# Altium schematic sheet CoreBase-V2.0.SchDoc
size A2
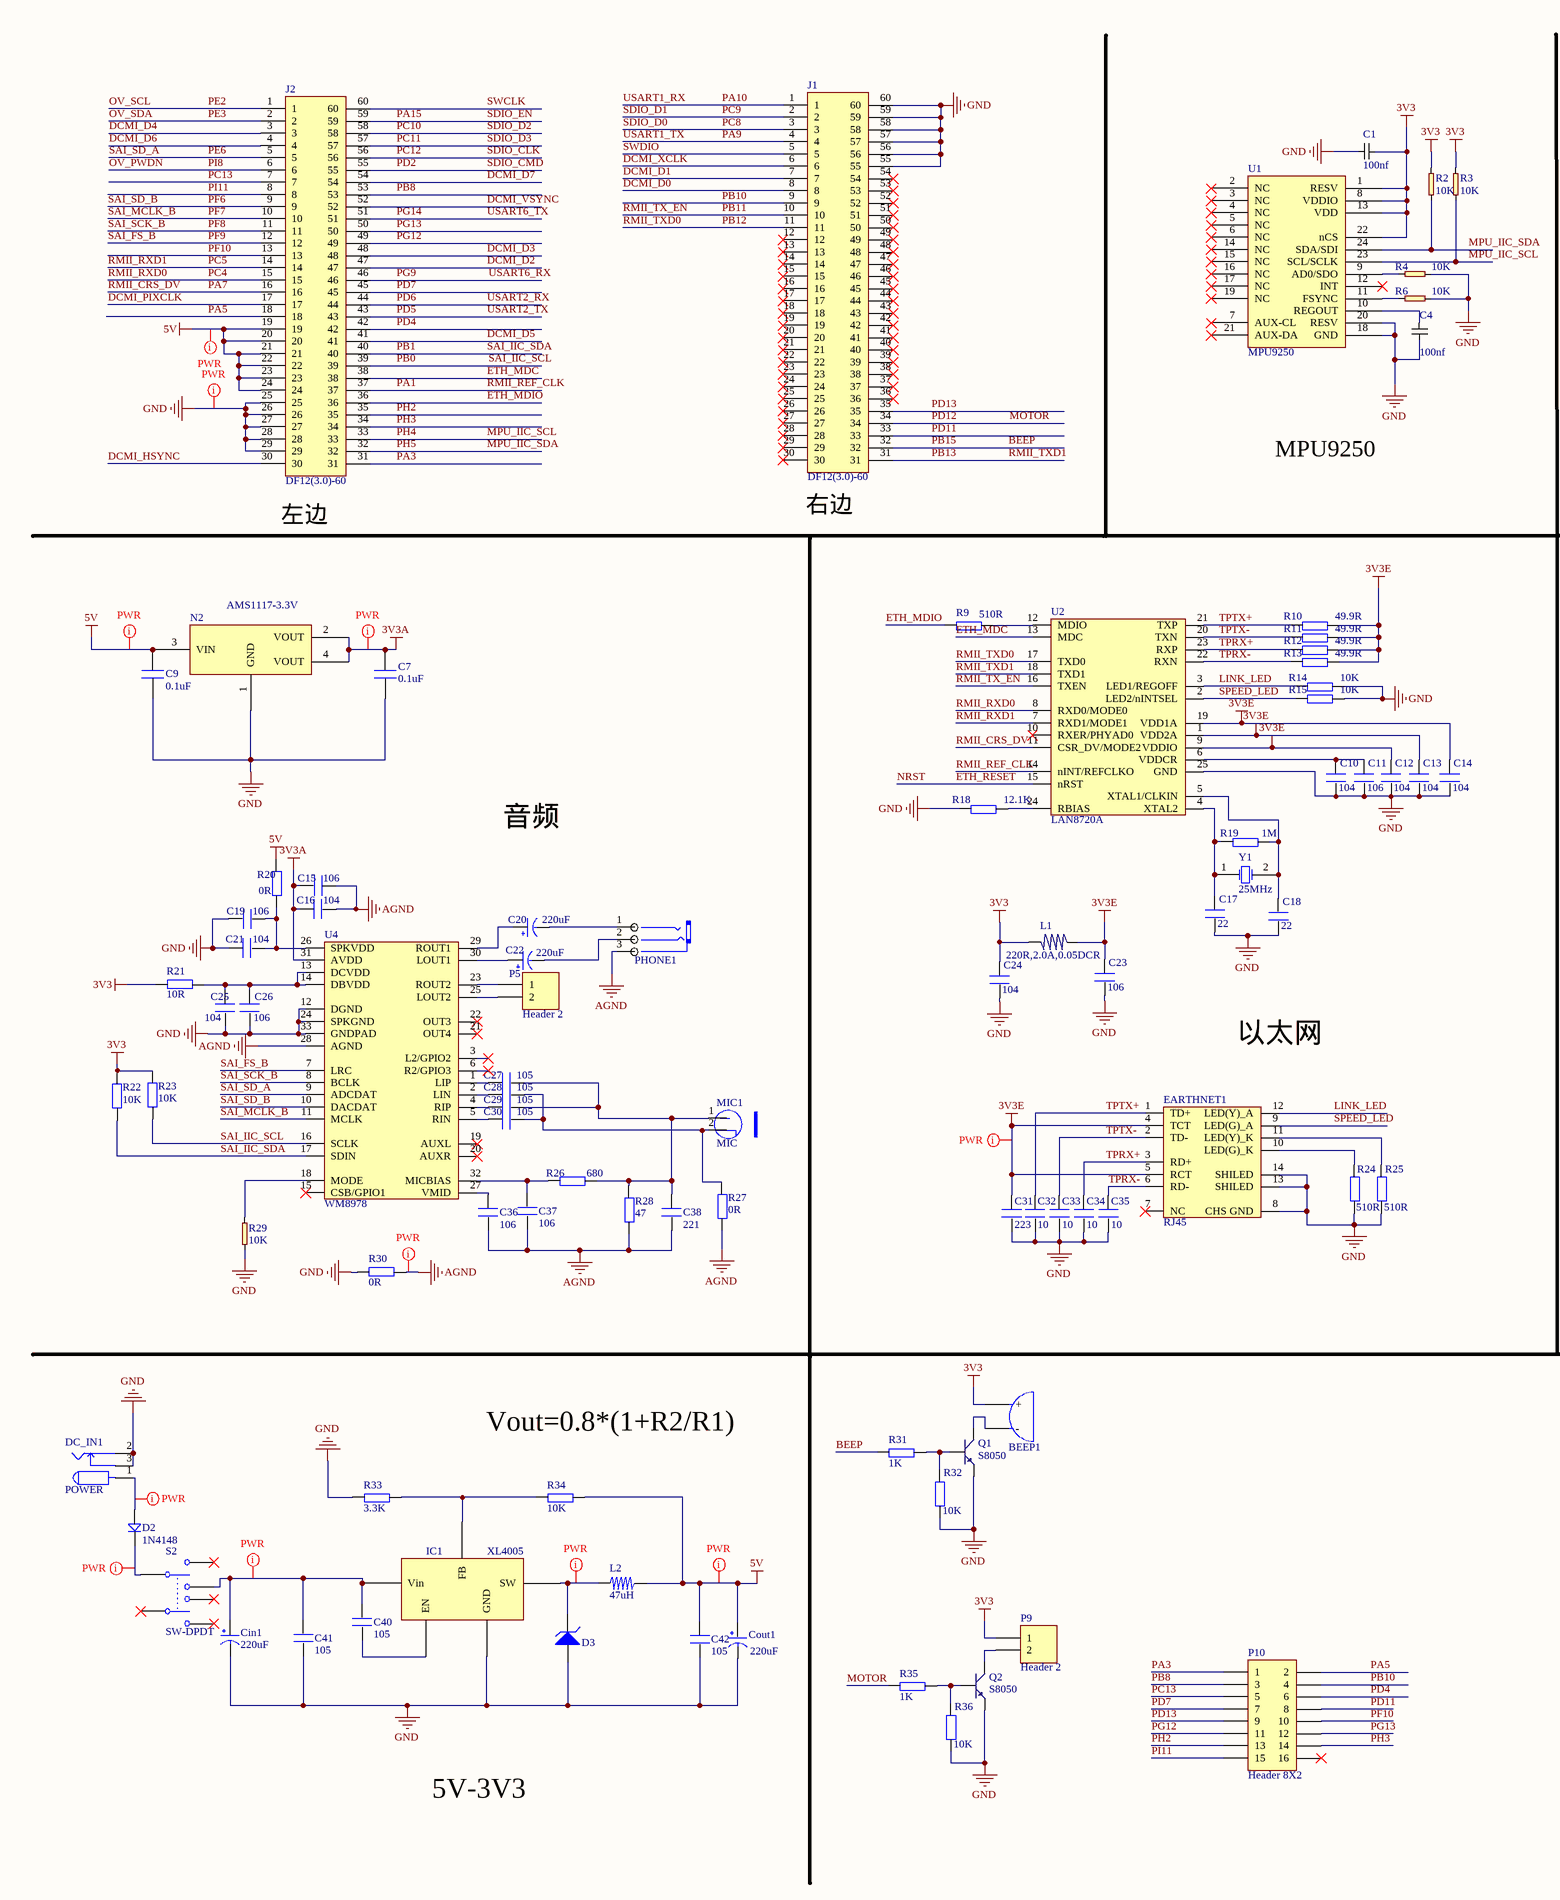
[diagram p0: CoreBase-V2.0.SchDoc, left]
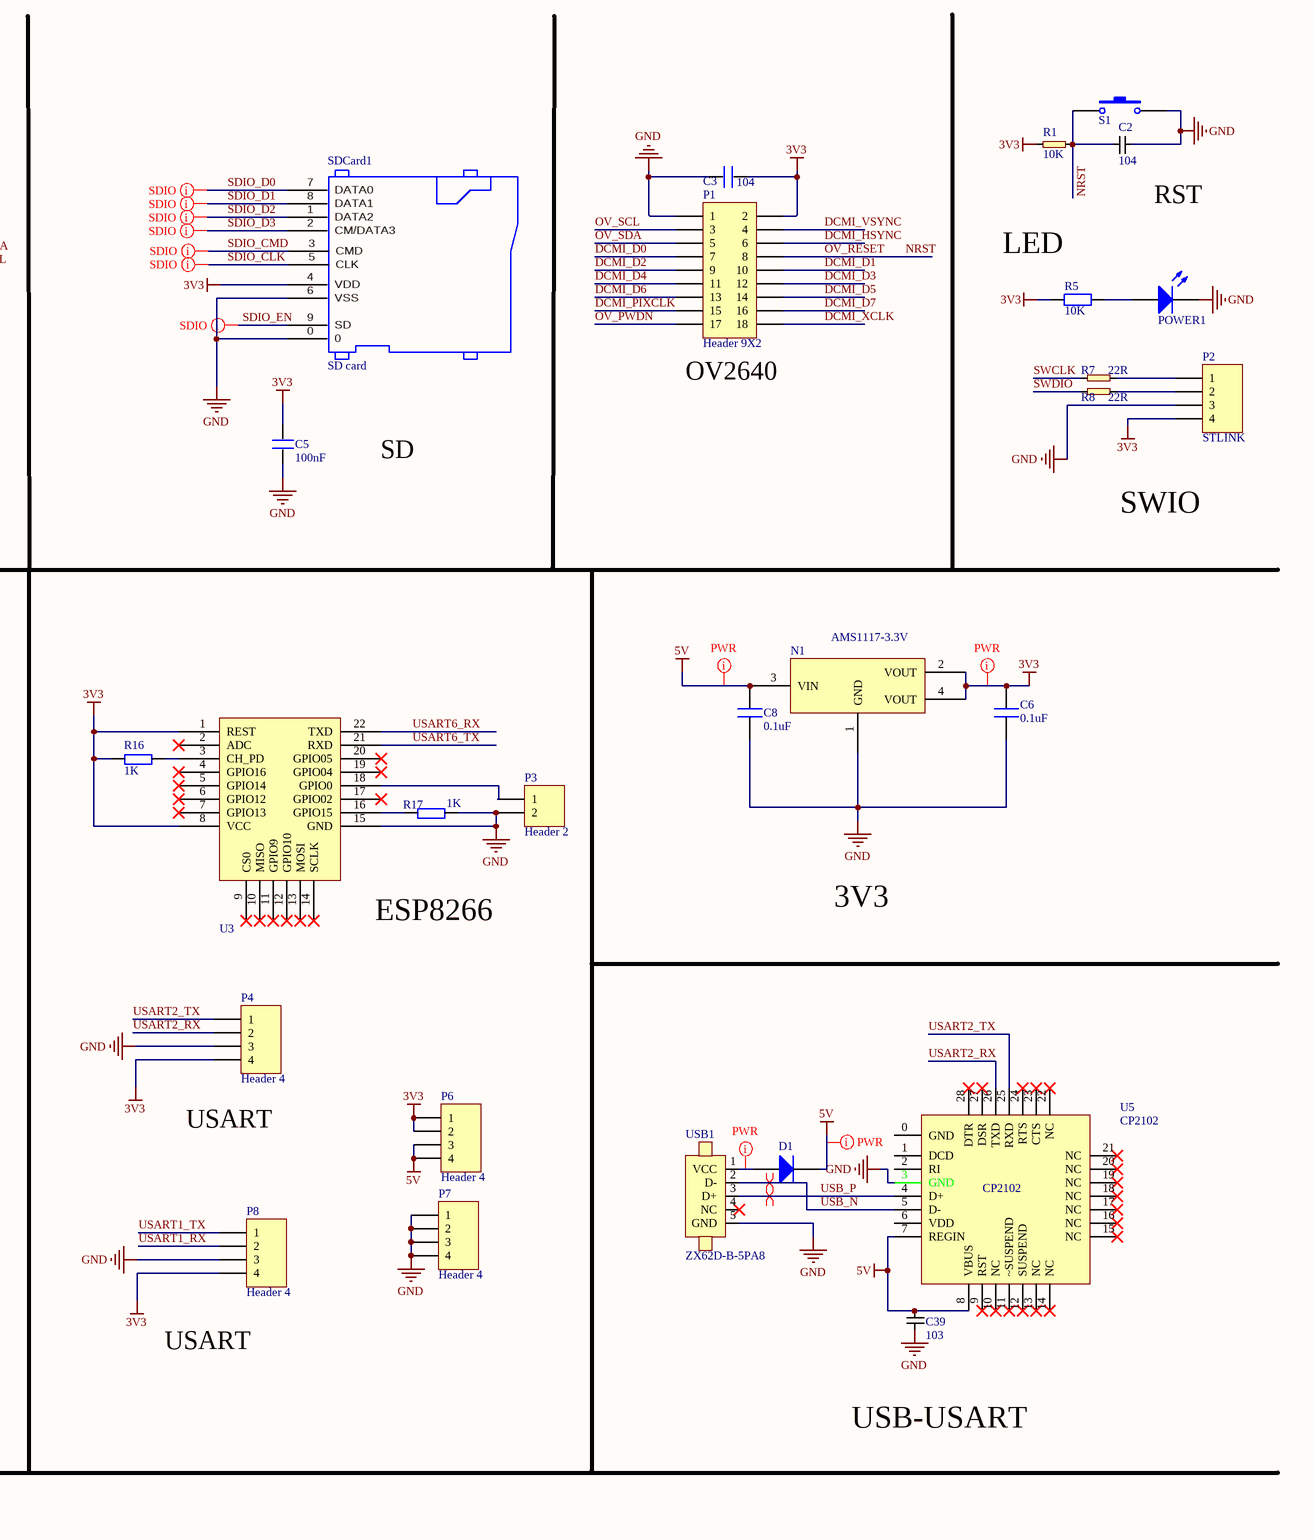
[diagram p1: CoreBase-V2.0.SchDoc, right]

## Parts
BEEP1  BEEP  [SOT12-7.6]  (value not drawn)
C1  100nf  [0603_C]
C2  104  [0603_C]
C3  104  [0603_C]
C4  100nf  [0603_C]
C5  100nF  [0603_C]
C6  0.1uF  [0603_C]
C7  0.1uF  [0603_C]
C8  0.1uF  [0603_C]
C9  0.1uF  [0603_C]
C10  104  [0603_C]
C11  106  [0603_C]
C12  104  [0603_C]
C13  104  [0603_C]
C14  104  [0603_C]
C15  106  [0603_C]
C16  104  [0603_C]
C17  22  [0603_C]
C18  22  [0603_C]
C19  106  [0603_C]
C20  220uF  [CC6.56.5]
C21  104  [0603_C]
C22  220uF  [CC6.56.5]
C23  106  [0603_C]
C24  104  [0603_C]
C25  104  [0603_C]
C26  106  [0603_C]
C27  105  [0603_C]
C28  105  [0603_C]
C29  105  [0603_C]
C30  105  [0603_C]
C31  223  [0603_C]
C32  10  [0603_C]
C33  10  [0603_C]
C34  10  [0603_C]
C35  10  [0603_C]
C36  106  [0603_C]
C37  106  [0603_C]
C38  221  [0603_C]
C39  103  [0603_C]
C40  105  [0603_C]
C41  105  [0603_C]
C42  105  [0603_C]
Cin1  220uF  [CC6.56.5]
Cout1  220uF  [CC6.56.5]
D1  1N5819  [SOD-123]  (value not drawn)
D2  1N4148  [SOD-123]
D3  Diode  Zener  [SMA(DO-214AC)]  (value not drawn)
DC_IN1  POWER  [DC10B]
EARTHNET1  RJ45  [HR911105A]
IC1  XL4005  [TO-263-5]
J1  DF12(3.0)-60  [DF12(3.0)-60DS-Top]
J2  DF12(3.0)-60  [DF12(3.0)-60DS-TOP]
L1  220R,2.0A,0.05DCR  [0603P]
L2  47uH  [L_SOP74]
MIC1  MIC  [MIC-6022]
N1  AMS1117-3.3V  [SOT223]
N2  AMS1117-3.3V  [SOT223]
P1  Header 9X2  [HDR2X9]
P2  STLINK  [HDR1X4]
P3  Header 2  [HDR1X2]
P4  Header 4  [HDR1X4]
P5  Header 2  [HDR1X2]
P6  Header 4  [HDR1X4]
P7  Header 4  [HDR1X4]
P8  Header 4  [HDR1X4]
P9  Header 2  [HDR1X2]
P10  Header 8X2  [HDR2X8]
PHONE1  PHONE  [PHONE_ST]  (value not drawn)
POWER1  LED  [0603P]  (value not drawn)
Q1  S8050  [SOT-23R]
Q2  S8050  [SOT-23R]
R1  10K  [0603_R]
R2  10K  [0603_R]
R3  10K  [0603_R]
R4  10K  [0603_R]
R5  10K  [0603_R]
R6  10K  [0603_R]
R7  22R  [0603_R]
R8  22R  [0603_R]
R9  510R  [0603_R]
R10  49.9R  [0603_R]
R11  49.9R  [0603_R]
R12  49.9R  [0603_R]
R13  49.9R  [0603_R]
R14  10K  [0603_R]
R15  10K  [0603_R]
R16  1K  [0603_R]
R17  1K  [0603_R]
R18  12.1K  [0603_R]
R19  1M  [0603_R]
R20  0R  [0603_R]
R21  10R  [0603_R]
R22  10K  [0603_R]
R23  10K  [0603_R]
R24  510R  [0603_R]
R25  510R  [0603_R]
R26  680  [0603_R]
R27  0R  [0603_R]
R28  47  [0603_R]
R29  10K  [0603_R]
R30  0R  [0603_R]
R31  1K  [0603_R]
R32  10K  [0603_R]
R33  3.3K  [0603_R]
R34  10K  [0603_R]
R35  1K  [0603_R]
R36  10K  [0603_R]
S1  SW-PB  [SW-3625]  (value not drawn)
S2  SW-DPDT  [SW-DPDT]
SDCard1  SD card  [SD_CARD]
U1  MPU9250  [QFN24]
U2  LAN8720A  [QFN24]
U3  ESP8266  [ESP-8266]  (value not drawn)
U4  WM8978  [WM8978]
U5  CP2102  [QFN-28]
USB1  ZX62D-B-5PA8  [Micro_USB]
Y1  25MHz  [XTAL_US]

## Nets
3V3: BEEP1.1(+) C1.1 C3.2 C5.2 C6.1 C24.2 L1.2 N1.2(VOUT) N1.4(VOUT) P1.2 P2.4 P4.4 P6.1 P6.2 P8.4 P9.1 R1.1 R2.2 R3.2 R5.1 R16.1 R21.2 R22.1 R23.1 SDCard1.4(VDD) U1.1(RESV) U1.8(VDDIO) U1.13(VDD) U1.22(nCS) U3.1(REST) U3.8(VCC)
3V3A: C7.1 C15.2 C16.1 N2.2(VOUT) N2.4(VOUT) U4.31(AVDD)
3V3E: C12.2 C13.2 C14.2 C23.2 C31.2 EARTHNET1.4(TCT) EARTHNET1.5(RCT) L1.1 R10.2 R11.2 R12.2 R13.2 U2.1(VDD2A) U2.9(VDDIO) U2.19(VDD1A)
5V: C8.1 C9.1 C39.2 C42.2 Cout1.1(VCC) D1.2(N) J2.19 J2.20 J2.21 J2.22 J2.23 J2.24 L2.1 N1.3(VIN) N2.3(VIN) P6.3 P6.4 R20.2 R34.2 U5.7(REGIN) U5.8(VBUS)
AGND: C15.1 C16.2 C36.1 C37.1 C38.1 PHONE1.3(COM) R27.1 R28.1 R30.1 U4.28(AGND)
GND: C1.2 C2.2 C3.1 C4.1 C5.1 C6.2 C7.2 C8.2 C9.2 C10.1 C11.1 C12.1 C13.1 C14.1 C17.1 C18.1 C19.2 C21.1 C23.1 C24.1 C25.1 C26.1 C31.1 C32.1 C33.1 C34.1 C35.1 C39.1 C41.1 C42.1 Cin1.2(GND) Cout1.2(GND) D3.1(A) DC_IN1.2 DC_IN1.3 EARTHNET1.8(CHS_GND) EARTHNET1.13(SHILED) EARTHNET1.14(SHILED) IC1.1(GND) J1.55 J1.56 J1.57 J1.58 J1.59 J1.60 J2.25 J2.26 J2.27 J2.28 J2.29 N1.1(GND) N2.1(GND) P1.1 P2.3 P3.2 P4.3 P7.1 P7.2 P7.3 P7.4 P8.3 POWER1.2(K) Q1.1(E) Q2.1(E) R4.1 R6.1 R14.2 R15.2 R17.2 R18.1 R24.1 R25.1 R29.1 R30.2 R32.1 R33.1 R36.1 S1.2 SDCard1.0 SDCard1.6(VSS) U1.18(GND) U1.20(RESV) U2.25(GND) U3.15(GND) U4.12(DGND) U4.24(SPKGND) U4.33(GNDPAD) U5.3(GND) USB1.5(GND)
BEEP: J1.32 R31.1  [also labelled PB15]
DCMI_D0: J1.8 P1.7
DCMI_D1: J1.7 P1.10
DCMI_D2: J2.47 P1.9
DCMI_D3: J2.48 P1.12
DCMI_D4: J2.3 P1.11
DCMI_D5: J2.41 P1.14
DCMI_D6: J2.4 P1.13
DCMI_D7: J2.54 P1.16
DCMI_HSYNC: J2.30 P1.6
DCMI_PIXCLK: J2.17 P1.15
DCMI_VSYNC: J2.52 P1.4
DCMI_XCLK: J1.6 P1.18
ETH_MDC: J2.38 U2.13(MDC)
ETH_MDIO: J2.36 R9.1
ETH_RESET: C2.1 P1.8 R1.2 S1.1 U2.15(nRST)  [also labelled NRST, OV_RESET]
LINK_LED: EARTHNET1.12(LED(Y)_A) R14.1 U2.3(LED1/REGOFF)
MOTOR: J1.34 R35.1  [also labelled PD12]
MPU_IIC_SCL: J2.33 R3.1 U1.23(SCL/SCLK)  [also labelled PH4]
MPU_IIC_SDA: J2.32 R2.1 U1.24(SDA/SDI)  [also labelled PH5]
OV_PWDN: J2.6 P1.17  [also labelled PI8]
OV_SCL: J2.1 P1.3  [also labelled PE2]
OV_SDA: J2.2 P1.5  [also labelled PE3]
PA1: J2.37 U2.14(nINT/REFCLKO)  [also labelled RMII_REF_CLK]
PA3: J2.31 P10.1
PA5: J2.18 P10.2
PA7: J2.16 U2.11(CSR_DV/MODE2)  [also labelled RMII_CRS_DV]
PA9: J1.4 P8.1  [also labelled USART1_TX]
PA10: J1.1 P8.2  [also labelled USART1_RX]
PA15: J2.59 SDCard1.9(SD)  [also labelled SDIO_EN]
PB0: J2.39 R23.2 U4.16(SCLK)  [also labelled SAI_IIC_SCL]
PB1: J2.40 R22.2 U4.17(SDIN)  [also labelled SAI_IIC_SDA]
PB8: J2.53 P10.3
PB10: J1.9 P10.4
PB11: J1.10 U2.16(TXEN)  [also labelled RMII_TX_EN]
PB12: J1.11 U2.17(TXD0)  [also labelled RMII_TXD0]
PB13: J1.31 U2.18(TXD1)  [also labelled RMII_TXD1]
PC4: J2.15 U2.8(RXD0/MODE0)  [also labelled RMII_RXD0]
PC5: J2.14 U2.7(RXD1/MODE1)  [also labelled RMII_RXD1]
PC8: J1.3 SDCard1.7(DATA0)  [also labelled SDIO_D0]
PC9: J1.2 SDCard1.8(DATA1)  [also labelled SDIO_D1]
PC10: J2.58 SDCard1.1(DATA2)  [also labelled SDIO_D2]
PC11: J2.57 SDCard1.2(CM/DATA3)  [also labelled SDIO_D3]
PC12: J2.56 SDCard1.5(CLK)  [also labelled SDIO_CLK]
PC13: J2.7 P10.5
PD2: J2.55 SDCard1.3(CMD)  [also labelled SDIO_CMD]
PD4: J2.42 P10.6
PD5: J2.43 P4.1 U5.25(RXD)  [also labelled USART2_TX]
PD6: J2.44 P4.2 U5.26(TXD)  [also labelled USART2_RX]
PD7: J2.45 P10.7
PD11: J1.33 P10.8
PD13: J1.35 P10.9
PE6: J2.5 U4.9(ADCDAT)  [also labelled SAI_SD_A]
PF6: J2.9 U4.10(DACDAT)  [also labelled SAI_SD_B]
PF7: J2.10 U4.11(MCLK)  [also labelled SAI_MCLK_B]
PF8: J2.11 U4.8(BCLK)  [also labelled SAI_SCK_B]
PF9: J2.12 U4.7(LRC)  [also labelled SAI_FS_B]
PF10: J2.13 P10.10
PG9: J2.46 U3.22(TXD)  [also labelled USART6_RX]
PG12: J2.49 P10.11
PG13: J2.50 P10.12
PG14: J2.51 U3.21(RXD)  [also labelled USART6_TX]
PH2: J2.35 P10.13
PH3: J2.34 P10.14
PI11: J2.8 P10.15
SPEED_LED: EARTHNET1.9(LED(G)_A) R15.1 U2.2(LED2/nINTSEL)
SWCLK: J2.60 R7.1
SWDIO: J1.5 R8.1
TPRX+: C34.2 EARTHNET1.3(RD+) R12.1 U2.23(RXP)
TPRX-: C35.2 EARTHNET1.6(RD-) R13.1 U2.22(RXN)
TPTX+: C32.2 EARTHNET1.1(TD+) R10.1 U2.21(TXP)
TPTX-: C33.2 EARTHNET1.2(TD-) R11.1 U2.20(TXN)
USB_N: U5.5(D-) USB1.2(D-)
USB_P: U5.4(D+) USB1.3(D+)
NetBEEP1_2: BEEP1.2(-) Q1.3(C)
NetC4_2: C4.2 U1.10(REGOUT)
NetC10_2: C10.2 C11.2 U2.6(VDDCR)
NetC17_2: C17.2 R19.1 U2.4(XTAL2) Y1.1(OSC1)
NetC18_2: C18.2 R19.2 U2.5(XTAL1/CLKIN) Y1.2(OSC2)
NetC19_1: C19.1 C21.2 R20.1 U4.26(SPKVDD)
NetC20_1: C20.1(VCC) U4.29(ROUT1)
NetC20_2: C20.2(GND) PHONE1.1(CHL)
NetC22_1: C22.1(VCC) U4.30(LOUT1)
NetC22_2: C22.2(GND) PHONE1.2(CHR)
NetC25_2: C25.2 C26.2 R21.1 U4.13(DCVDD) U4.14(DBVDD)
NetC27_1: C27.1 U4.1(LIP)
NetC27_2: C27.2 C29.2 C38.2 MIC1.1(VCC) R26.2 R28.2
NetC28_1: C28.1 U4.2(LIN)
NetC28_2: C28.2 C30.2 MIC1.2(GND) R27.2
NetC29_1: C29.1 U4.4(RIP)
NetC30_1: C30.1 U4.5(RIN)
NetC36_2: C36.2 U4.27(VMID)
NetC37_2: C37.2 R26.1 U4.32(MICBIAS)
NetC40_1: C40.1 IC1.4(EN)
NetC40_2: C40.2 C41.2 Cin1.1(VCC) IC1.5(Vin) S2.3
NetD1_1: D1.1(P) USB1.1(VCC)
NetD2_1: D2.1 DC_IN1.1
NetD2_2: D2.2 S2.2
NetD3_2: D3.2(K) IC1.3(SW) L2.2
NetEARTHNET1_10: EARTHNET1.10(LED(G)_K) R24.2
NetEARTHNET1_11: EARTHNET1.11(LED(Y)_K) R25.2
NetIC1_2: IC1.2(FB) R33.2 R34.1
NetP2_1: P2.1 R7.2
NetP2_2: P2.2 R8.2
NetP3_1: P3.1 U3.18(GPIO0)
NetP5_1: P5.1 U4.23(ROUT2)
NetP5_2: P5.2 U4.25(LOUT2)
NetP9_2: P9.2 Q2.3(C)
NetPOWER1_1: POWER1.1(A) R5.2
NetQ1_2: Q1.2(B) R31.2 R32.2
NetQ2_2: Q2.2(B) R35.2 R36.2
NetR4_2: R4.2 U1.9(AD0/SDO)
NetR6_2: R6.2 U1.11(FSYNC)
NetR9_2: R9.2 U2.12(MDIO)
NetR16_2: R16.2 U3.3(CH_PD)
NetR17_1: R17.1 U3.16(GPIO15)
NetR18_2: R18.2 U2.24(RBIAS)
NetR29_2: R29.2 U4.18(MODE)

Not connected (* = marked no-connect by the designer): EARTHNET1 7(NC)*; J1 12* 13* 14* 15* 16* 17* 18* 19* 20* 21* 22* 23* 24* 25* 26* 27* 28* 29* 30* 36* 37* 38* 39* 40* 41* 42* 43* 44* 45* 46* 47* 48* 49* 50* 51* 52* 53* 54*; P10 16*; S2 1* 4* 5* 6*; U1 2(NC)* 3(NC)* 4(NC)* 5(NC)* 6(NC)* 7(AUX-CL)* 12(INT)* 14(NC)* 15(NC)* 16(NC)* 17(NC)* 19(NC)* 21(AUX-DA)*; U2 10(RXER/PHYAD0)*; U3 2(ADC)* 4(GPIO16)* 5(GPIO14)* 6(GPIO12)* 7(GPIO13)* 9(CS0)* 10(MISO)* 11(GPIO9)* 12(GPIO10)* 13(MOSI)* 14(SCLK)* 17(GPIO02)* 19(GPIO04)* 20(GPIO05)*; U4 3(L2/GPIO2)* 6(R2/GPIO3)* 15(CSB/GPIO1)* 19(AUXL)* 20(AUXR)* 21(OUT4)* 22(OUT3)*; U5 0(GND) 1(DCD) 2(RI) 6(VDD) 9(RST)* 10(NC)* 11(~SUSPEND)* 12(SUSPEND)* 13(NC)* 14(NC)* 15(NC)* 16(NC)* 17(NC)* 18(NC)* 19(NC)* 20(NC)* 21(NC)* 22(NC)* 23(CTS)* 24(RTS)* 27(DSR)* 28(DTR)*; USB1 4(NC)*

## Layout directives
net class SDIO: PA15, PC8, PC9, PC10, PC11, PC12, PD2
net class PWR: 3V3, 3V3A, 3V3E, 5V, AGND, GND, NetC40_2, NetD1_1, NetD2_1, NetD2_2, NetD3_2
differential pair: USB_N, USB_P

## Notes on the sheet
- RST
- (near R5) LED
- (near P1) OV2640
- MPU9250
- SD
- (near J2) 左边
- (near J1) 右边
- SWIO
- 音频
- (near U3) ESP8266
- 3V3
- 以太网
- (near P4) USART
- USART
- USB-USART
- Vout=0.8*(1+R2/R1)
- 5V-3V3

## Library data of the parts
C1-C5 C10-C19 C21 C23-C42 = C
C6-C9 = 普通贴片电容: Capacitor
C20 C22 Cin1 Cout1 = CAP
D1 D2 = D
D3 = Diode  Zener: Zener Diode; Published: 8-Jun-2000; Revision: July-2002: Re-released for DXP Platform.; Publisher: Altium Limited
DC_IN1 = POW
EARTHNET1 = HR911105
L1 = L
L2 = L_SOP
P1 = Header 9X2: Header, 9-Pin, Dual row; LatestRevisionDate: 17-Jul-2002; LatestRevisionNote: Re-released for DXP Platform.; Publisher: Altium Limited
P2 P4 P6-P8 = Header 4: Header, 4-Pin; LatestRevisionDate: 17-Jul-2002; LatestRevisionNote: Re-released for DXP Platform.; Publisher: Altium Limited
P3 P5 P9 = Header 2: Header, 2-Pin; LatestRevisionDate: 17-Jul-2002; LatestRevisionNote: Re-released for DXP Platform.; Publisher: Altium Limited
P10 = Header 8X2: Header, 8-Pin, Dual row; LatestRevisionDate: 17-Jul-2002; LatestRevisionNote: Re-released for DXP Platform.; Publisher: Altium Limited
PHONE1 = PHONE_M
Q1 Q2 = NPN: 8050/BCW846/BCW847
R1-R4 R6-R36 = R
R5 = Res: value: 10K
S2 = SW-DPDT: Double-Pole, Double-Throw Switch; Published: 24-Mar-1999; LatestRevisionDate: 17-Jul-2002; LatestRevisionNote: Re-released for DXP Platform.; PackageReference: DPDT-6; Publisher: Altium Limited
U2 = LAN8720: ETH PHY
U4 = WM8978: 24bit ADC&DAC
USB1 = micro usb
Y1 = XTAL: Crystal Oscillator; Published: 8-Jun-2000; LatestRevisionDate: 17-Jul-2002; LatestRevisionNote: Re-released for DXP Platform.; Publisher: Altium Limited